# Altium project Cheetah.PrjPcb
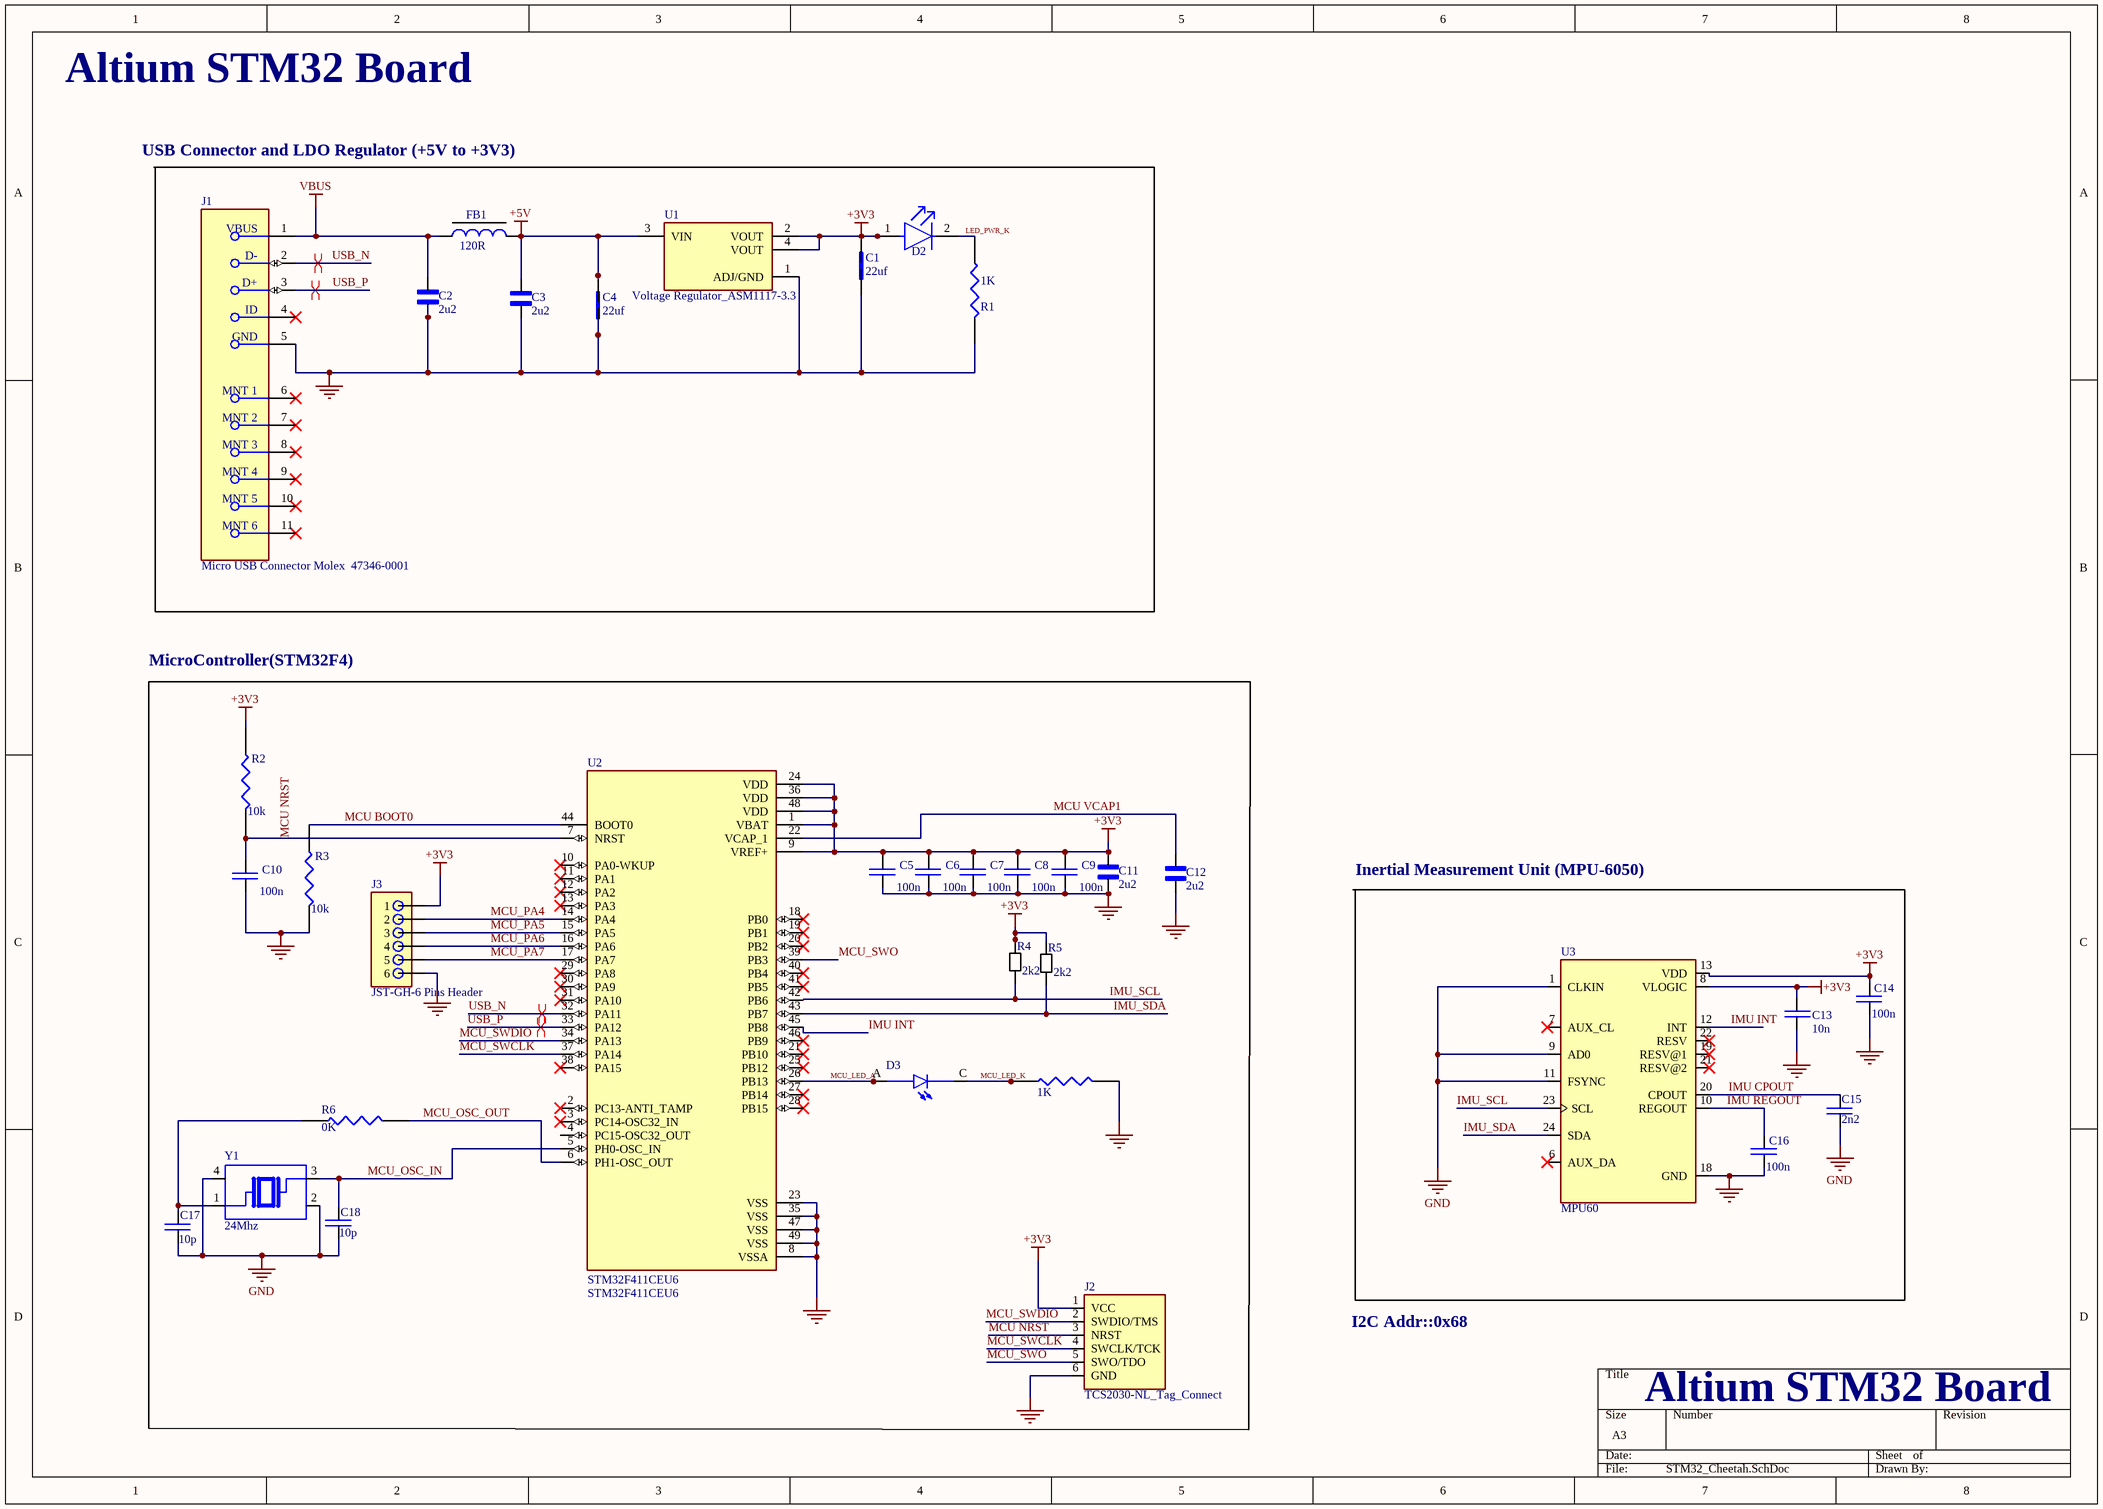
[diagram p0: STM32_Cheetah.SchDoc]
1 sheet, 35 parts. Net scope: global (net labels, ports and power ports of the same name join across sheets).
Board file: Copy of Copy of PCB1_backup.~(47).~(13) new.PcbDoc

## Sheet STM32_Cheetah.SchDoc
size A3; SheetNumber: 1; SheetTotal: 1

### Parts
1K  Resistor_0402_Generic  [Resistor_0402_Generic]  (value not drawn)
C1  22uf  [CAPC2012X140N]
C2  2u2  [CAP_0603_Generic]
C3  2u2  [CAP_0603_Generic]
C4  22uf  [CAPC2012X140N]
C5  100n  [CAP_0402_Generic]
C6  100n  [CAP_0402_Generic]
C7  100n  [CAP_0402_Generic]
C8  100n  [CAP_0402_Generic]
C9  100n  [CAP_0402_Generic]
C10  100n  [CAP_0402_Generic]
C11  2u2  [CAP_0603_Generic]
C12  2u2  [CAP_0603_Generic]
C13  10n  [CAP_0402_Generic]
C14  100n  [CAP_0402_Generic]
C15  2n2  [CAP_0402_Generic]
C16  100n  [CAP_0402_Generic]
C17  10p  [CAP_0402_Generic]
C18  10p  [CAP_0402_Generic]
D2  LED Green Wurth Elektronik 150080GS75000  [LED 0508 Green SMT]  (value not drawn)
D3  0402 RED LED  [RED_LED_0402]  (value not drawn)
FB1  120R  [FB 0603]
J1  Micro USB Connector Molex  47346-0001  [Molex_0_MFG]
J2  TCS2030-NL_Tag_Connect  [TCS_Tag-Connect]
J3  JST-GH-6 Pins Header  [JST-GH 6 Pins Connector]
R1  1K  [Resistor_0402_Generic]
R2  10k  [Resistor_0402_Generic]
R3  10k  [Resistor_0402_Generic]
R4  2k2  [Resistor_0402_Generic]
R5  2k2  [Resistor_0402_Generic]
R6  0K  [Resistor_0402_Generic]
U1  Voltage Regulator_ASM1117-3.3  [Voltage_Regulator ASM1117-3.3]
U2  STM32F411CEU6  [STM32F411CEU6]
U3  MPU60  [MPU60]
Y1  24Mhz  [TSX-Crystal Oscillator 24Mhz]

### Blocks framed on the sheet
MicroController(STM32F4): 1K C5-C12 C17 C18 D3 J2 J3 R2-R6 U2 Y1
Inertial Measurement Unit (MPU-6050): C13-C16 U3

### Nets
+3V3: C1.2 C5.2 C6.2 C7.2 C8.2 C9.2 C11.2 C13.1 C14.2 D2.1(A) J2.1(VCC) J3.1 R2.2 R4.2 R5.2 U1.2(VOUT) U1.4(VOUT) U2.1(VBAT) U2.9(VREF+) U2.24(VDD) U2.36(VDD) U2.48(VDD) U3.8(VLOGIC) U3.13(VDD)
+5V: C3.2 C4.2 FB1.2 U1.3(VIN)
GND: 1K.1 C1.1 C2.1 C3.1 C4.1 C5.1 C6.1 C7.1 C8.1 C9.1 C10.1 C11.1 C12.1 C13.2 C14.1 C15.1 C16.1 C17.1 C18.1 J1.5(GND) J2.6(GND) J3.6 R1.1 R3.1 U1.1(ADJ/GND) U2.8(VSSA) U2.23(VSS) U2.35(VSS) U2.47(VSS) U2.49(VSS) U3.1(CLKIN) U3.9(AD0) U3.11(FSYNC) U3.18(GND) Y1.2 Y1.4
VBUS: C2.2 FB1.1 J1.1(VBUS)
IMU CPOUT: C15.2 U3.20(CPOUT)
IMU INT: U2.45(PB8) U3.12(INT)
IMU REGOUT: C16.2 U3.10(REGOUT)
IMU_SCL: R4.1 U2.42(PB6) U3.23(SCL)
IMU_SDA: R5.1 U2.43(PB7) U3.24(SDA)
LED_PWR_K: D2.2(C) R1.2
MCU BOOT0: R3.2 U2.44(BOOT0)
MCU NRST: C10.2 J2.3(NRST) R2.1 U2.7(NRST)
MCU VCAP1: C12.2 U2.22(VCAP_1)
MCU_LED_A: D3.A U2.26(PB13)
MCU_LED_K: 1K.2 D3.C
MCU_OSC_IN: C18.2 U2.5(PH0-OSC_IN) Y1.3
MCU_OSC_OUT: R6.1 U2.6(PH1-OSC_OUT)
MCU_PA4: J3.2 U2.14(PA4)
MCU_PA5: J3.3 U2.15(PA5)
MCU_PA6: J3.4 U2.16(PA6)
MCU_PA7: J3.5 U2.17(PA7)
MCU_SWCLK: J2.4(SWCLK/TCK) U2.37(PA14)
MCU_SWDIO: J2.2(SWDIO/TMS) U2.34(PA13)
MCU_SWO: J2.5(SWO/TDO) U2.39(PB3)
USB_N: J1.2(D-) U2.32(PA11)
USB_P: J1.3(D+) U2.33(PA12)
NetC17_2: C17.2 R6.2 Y1.1

Not connected (* = marked no-connect by the designer): J1 4(ID)* 6(MNT_1)* 7(MNT_2)* 8(MNT_3)* 9(MNT_4)* 10(MNT_5)* 11(MNT_6)*; U2 2(PC13-ANTI_TAMP)* 3(PC14-OSC32_IN)* 4(PC15-OSC32_OUT) 10(PA0-WKUP)* 11(PA1)* 12(PA2)* 13(PA3)* 18(PB0)* 19(PB1)* 20(PB2)* 21(PB10)* 25(PB12)* 27(PB14)* 28(PB15)* 29(PA8)* 30(PA9)* 31(PA10)* 38(PA15)* 40(PB4)* 41(PB5)* 46(PB9)*; U3 6(AUX_DA)* 7(AUX_CL)* 19(RESV@1)* 21(RESV@2)* 22(RESV)*

### Layout directives
differential pair; differential pair class DEF_USB: USB_N, USB_P

### Notes on the sheet
- Altium STM32 Board
- USB Connector and LDO Regulator (+5V to +3V3)
- I2C Addr::0x68

### Library data of the parts
1K R1-R6 = Resistor_0402_Generic: 130 kOhms Â±5% 0.1W, 1/10W Chip Resistor 0402 (1005 Metric) Automotive AEC-Q200 Thick Film
C1 C4 = CAPC2012X140N-Capacitor0805: COMMERCIAL CHIP STD JAPAN BULK - FN TAPE/REEL, 7 INCH PAPER TAPE
C2 C3 C11 C12 = CAP_0603_Generic: 0.022 ÂµF Â±5% 16V Ceramic Capacitor X7R 0603 (1608 Metric)
C5-C10 C13-C18 = CAP_0402_Generic: 0.022 ÂµF Â±5% 16V Ceramic Capacitor X7R 0603 (1608 Metric)
D2 = LED Green Wurth Elektronik 150080GS75000: WURTH ELEKTRONIK - 150080GS75000 - LED, Green, SMD, 0805, 30 mA, 3.2 V, 520 nm
D3 = 0402 RED LED: LED, PICOLED, Red, 621 nm, 1.8 V, 1 mA, 2.5 mcd
FB1 = Ferrite Bead SMD 0603
J1 = Micro USB Connector Molex  47346-0001: PN-473460001
J2 = TCS2030-NL_Tag_Connect: Tag_Connect_CABLE ADAPTER 6 POS
J3 = JST-GH-6 Pins Header: Connector Header Surface Mount 6 position 0.059 (1.50mm)
U1 = Voltage Regulator_ASM1117-3.3: 1A LOW DROPOUT VOLTAGE REGULATOR SOT-223
U2 = STM32F411CEU6: High-performance access line, ARM Cortex-M4 core with DSP and FPU, 512 Kbytes Flash, 100 MHz CPU, ART Accelerator
U3 = MPU60: MPU-6050 series Accelerometer, Gyroscope, 3 Axis Sensor Evaluation Board
Y1 = Crystal Socillator 24Mhz TSX-322524: 24MHz Â±10ppm Crystal 9pF 40 Ohms 4-SMD, No Lead